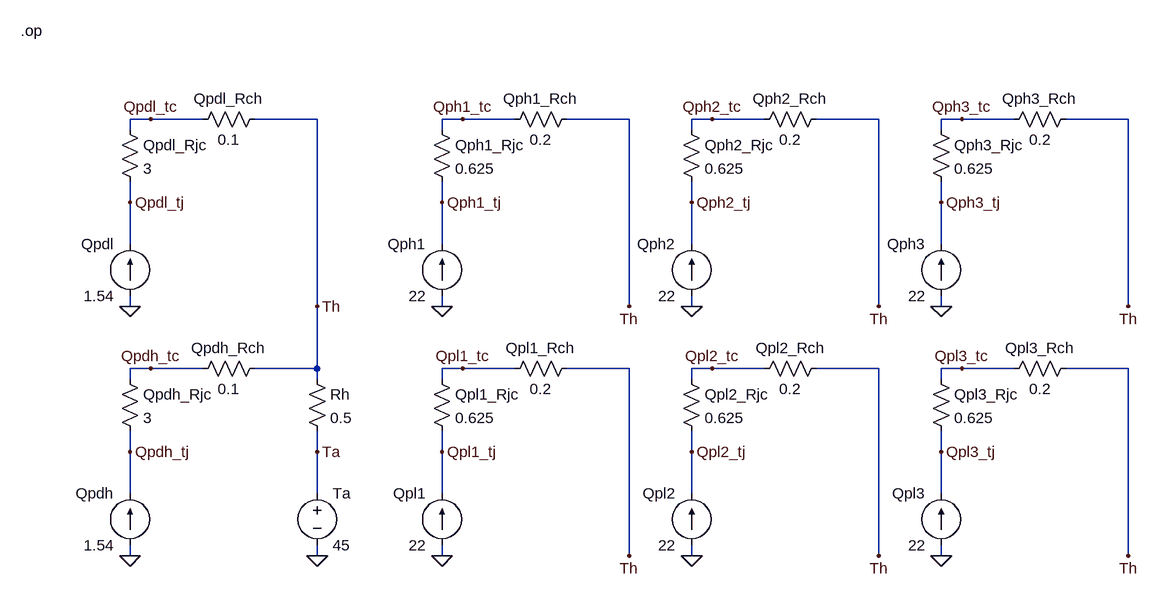
[diagram p0: schematic pab3bbb-arguo-thermal.asc]
pab3bbb-arguo-thermal.asc, the LTspice schematic file:
Version 4
SHEET 1 896 680
WIRE -640 -544 -672 -544
WIRE -560 -544 -640 -544
WIRE -384 -544 -480 -544
WIRE -160 -544 -192 -544
WIRE -80 -544 -160 -544
WIRE 96 -544 0 -544
WIRE 224 -544 192 -544
WIRE 304 -544 224 -544
WIRE 480 -544 384 -544
WIRE 608 -544 576 -544
WIRE 688 -544 608 -544
WIRE 864 -544 768 -544
WIRE -672 -528 -672 -544
WIRE -192 -528 -192 -544
WIRE 192 -528 192 -544
WIRE 576 -528 576 -544
WIRE -672 -416 -672 -448
WIRE -192 -416 -192 -448
WIRE 192 -416 192 -448
WIRE 576 -416 576 -448
WIRE -672 -352 -672 -416
WIRE -192 -352 -192 -416
WIRE 192 -352 192 -416
WIRE 576 -352 576 -416
WIRE -672 -256 -672 -272
WIRE -384 -256 -384 -544
WIRE -192 -256 -192 -272
WIRE 96 -256 96 -544
WIRE 192 -256 192 -272
WIRE 480 -256 480 -544
WIRE 576 -256 576 -272
WIRE 864 -256 864 -544
WIRE -640 -160 -672 -160
WIRE -560 -160 -640 -160
WIRE -384 -160 -384 -256
WIRE -384 -160 -480 -160
WIRE -160 -160 -192 -160
WIRE -80 -160 -160 -160
WIRE 96 -160 0 -160
WIRE 224 -160 192 -160
WIRE 304 -160 224 -160
WIRE 480 -160 384 -160
WIRE 608 -160 576 -160
WIRE 688 -160 608 -160
WIRE 864 -160 768 -160
WIRE -672 -144 -672 -160
WIRE -384 -144 -384 -160
WIRE -192 -144 -192 -160
WIRE 192 -144 192 -160
WIRE 576 -144 576 -160
WIRE -672 -32 -672 -64
WIRE -384 -32 -384 -64
WIRE -192 -32 -192 -64
WIRE 192 -32 192 -64
WIRE 576 -32 576 -64
WIRE -672 32 -672 -32
WIRE -384 32 -384 -32
WIRE -192 32 -192 -32
WIRE 192 32 192 -32
WIRE 576 32 576 -32
WIRE -672 128 -672 112
WIRE -384 128 -384 112
WIRE -192 128 -192 112
WIRE 96 128 96 -160
WIRE 192 128 192 112
WIRE 480 128 480 -160
WIRE 576 128 576 112
WIRE 864 128 864 -160
FLAG -672 128 0
FLAG -640 -160 Qpdh_tc
FLAG -672 -256 0
FLAG -640 -544 Qpdl_tc
FLAG -384 128 0
FLAG -384 -256 Th
FLAG -672 -32 Qpdh_tj
FLAG -672 -416 Qpdl_tj
FLAG -192 -256 0
FLAG -160 -544 Qph1_tc
FLAG 96 -256 Th
FLAG -192 -416 Qph1_tj
FLAG -384 -32 Ta
FLAG 192 -256 0
FLAG 224 -544 Qph2_tc
FLAG 480 -256 Th
FLAG 192 -416 Qph2_tj
FLAG 576 -256 0
FLAG 608 -544 Qph3_tc
FLAG 864 -256 Th
FLAG 576 -416 Qph3_tj
FLAG -192 128 0
FLAG -160 -160 Qpl1_tc
FLAG 96 128 Th
FLAG -192 -32 Qpl1_tj
FLAG 192 128 0
FLAG 224 -160 Qpl2_tc
FLAG 480 128 Th
FLAG 192 -32 Qpl2_tj
FLAG 576 128 0
FLAG 608 -160 Qpl3_tc
FLAG 864 128 Th
FLAG 576 -32 Qpl3_tj
SYMBOL current -672 112 R180
WINDOW 0 24 80 Left 2
WINDOW 3 24 0 Left 2
WINDOW 123 0 0 Left 0
WINDOW 39 0 0 Left 0
SYMATTR InstName Qpdh
SYMATTR Value 1.54
SYMBOL res -688 -160 R0
SYMATTR InstName Qpdh_Rjc
SYMATTR Value 3
SYMBOL res -464 -176 R90
WINDOW 0 0 56 VBottom 2
WINDOW 3 32 56 VTop 2
SYMATTR InstName Qpdh_Rch
SYMATTR Value 0.1
SYMBOL current -672 -272 R180
WINDOW 0 24 80 Left 2
WINDOW 3 24 0 Left 2
WINDOW 123 0 0 Left 0
WINDOW 39 0 0 Left 0
SYMATTR InstName Qpdl
SYMATTR Value 1.54
SYMBOL res -688 -544 R0
SYMATTR InstName Qpdl_Rjc
SYMATTR Value 3
SYMBOL res -464 -560 R90
WINDOW 0 0 56 VBottom 2
WINDOW 3 32 56 VTop 2
SYMATTR InstName Qpdl_Rch
SYMATTR Value 0.1
SYMBOL voltage -384 16 R0
WINDOW 123 0 0 Left 0
WINDOW 39 0 0 Left 0
SYMATTR InstName Ta
SYMATTR Value 45
SYMBOL res -400 -160 R0
SYMATTR InstName Rh
SYMATTR Value 0.5
SYMBOL current -192 -272 R180
WINDOW 0 24 80 Left 2
WINDOW 3 24 0 Left 2
WINDOW 123 0 0 Left 0
WINDOW 39 0 0 Left 0
SYMATTR InstName Qph1
SYMATTR Value 22
SYMBOL res -208 -544 R0
SYMATTR InstName Qph1_Rjc
SYMATTR Value 0.625
SYMBOL res 16 -560 R90
WINDOW 0 0 56 VBottom 2
WINDOW 3 32 56 VTop 2
SYMATTR InstName Qph1_Rch
SYMATTR Value 0.2
SYMBOL current 192 -272 R180
WINDOW 0 24 80 Left 2
WINDOW 3 24 0 Left 2
WINDOW 123 0 0 Left 0
WINDOW 39 0 0 Left 0
SYMATTR InstName Qph2
SYMATTR Value 22
SYMBOL res 176 -544 R0
SYMATTR InstName Qph2_Rjc
SYMATTR Value 0.625
SYMBOL res 400 -560 R90
WINDOW 0 0 56 VBottom 2
WINDOW 3 32 56 VTop 2
SYMATTR InstName Qph2_Rch
SYMATTR Value 0.2
SYMBOL current 576 -272 R180
WINDOW 0 24 80 Left 2
WINDOW 3 24 0 Left 2
WINDOW 123 0 0 Left 0
WINDOW 39 0 0 Left 0
SYMATTR InstName Qph3
SYMATTR Value 22
SYMBOL res 560 -544 R0
SYMATTR InstName Qph3_Rjc
SYMATTR Value 0.625
SYMBOL res 784 -560 R90
WINDOW 0 0 56 VBottom 2
WINDOW 3 32 56 VTop 2
SYMATTR InstName Qph3_Rch
SYMATTR Value 0.2
SYMBOL current -192 112 R180
WINDOW 0 24 80 Left 2
WINDOW 3 24 0 Left 2
WINDOW 123 0 0 Left 0
WINDOW 39 0 0 Left 0
SYMATTR InstName Qpl1
SYMATTR Value 22
SYMBOL res -208 -160 R0
SYMATTR InstName Qpl1_Rjc
SYMATTR Value 0.625
SYMBOL res 16 -176 R90
WINDOW 0 0 56 VBottom 2
WINDOW 3 32 56 VTop 2
SYMATTR InstName Qpl1_Rch
SYMATTR Value 0.2
SYMBOL current 192 112 R180
WINDOW 0 24 80 Left 2
WINDOW 3 24 0 Left 2
WINDOW 123 0 0 Left 0
WINDOW 39 0 0 Left 0
SYMATTR InstName Qpl2
SYMATTR Value 22
SYMBOL res 176 -160 R0
SYMATTR InstName Qpl2_Rjc
SYMATTR Value 0.625
SYMBOL res 400 -176 R90
WINDOW 0 0 56 VBottom 2
WINDOW 3 32 56 VTop 2
SYMATTR InstName Qpl2_Rch
SYMATTR Value 0.2
SYMBOL current 576 112 R180
WINDOW 0 24 80 Left 2
WINDOW 3 24 0 Left 2
WINDOW 123 0 0 Left 0
WINDOW 39 0 0 Left 0
SYMATTR InstName Qpl3
SYMATTR Value 22
SYMBOL res 560 -160 R0
SYMATTR InstName Qpl3_Rjc
SYMATTR Value 0.625
SYMBOL res 784 -176 R90
WINDOW 0 0 56 VBottom 2
WINDOW 3 32 56 VTop 2
SYMATTR InstName Qpl3_Rch
SYMATTR Value 0.2
TEXT -840 -680 Left 2 !.op

The netlist it stands for:
* pab3bbb-arguo-thermal.asc
I§Qpdh 0 Qpdh_tj 1.54
R§Qpdh_Rjc Qpdh_tc Qpdh_tj 3
R§Qpdh_Rch Th Qpdh_tc 0.1
I§Qpdl 0 Qpdl_tj 1.54
R§Qpdl_Rjc Qpdl_tc Qpdl_tj 3
R§Qpdl_Rch Th Qpdl_tc 0.1
V§Ta Ta 0 45
Rh Th Ta 0.5
I§Qph1 0 Qph1_tj 22
R§Qph1_Rjc Qph1_tc Qph1_tj 0.625
R§Qph1_Rch Th Qph1_tc 0.2
I§Qph2 0 Qph2_tj 22
R§Qph2_Rjc Qph2_tc Qph2_tj 0.625
R§Qph2_Rch Th Qph2_tc 0.2
I§Qph3 0 Qph3_tj 22
R§Qph3_Rjc Qph3_tc Qph3_tj 0.625
R§Qph3_Rch Th Qph3_tc 0.2
I§Qpl1 0 Qpl1_tj 22
R§Qpl1_Rjc Qpl1_tc Qpl1_tj 0.625
R§Qpl1_Rch Th Qpl1_tc 0.2
I§Qpl2 0 Qpl2_tj 22
R§Qpl2_Rjc Qpl2_tc Qpl2_tj 0.625
R§Qpl2_Rch Th Qpl2_tc 0.2
I§Qpl3 0 Qpl3_tj 22
R§Qpl3_Rjc Qpl3_tc Qpl3_tj 0.625
R§Qpl3_Rch Th Qpl3_tc 0.2
.op
.backanno
.end